# Altium schematic sheet cs301_YourGroupNumber3.SchDoc
size A4
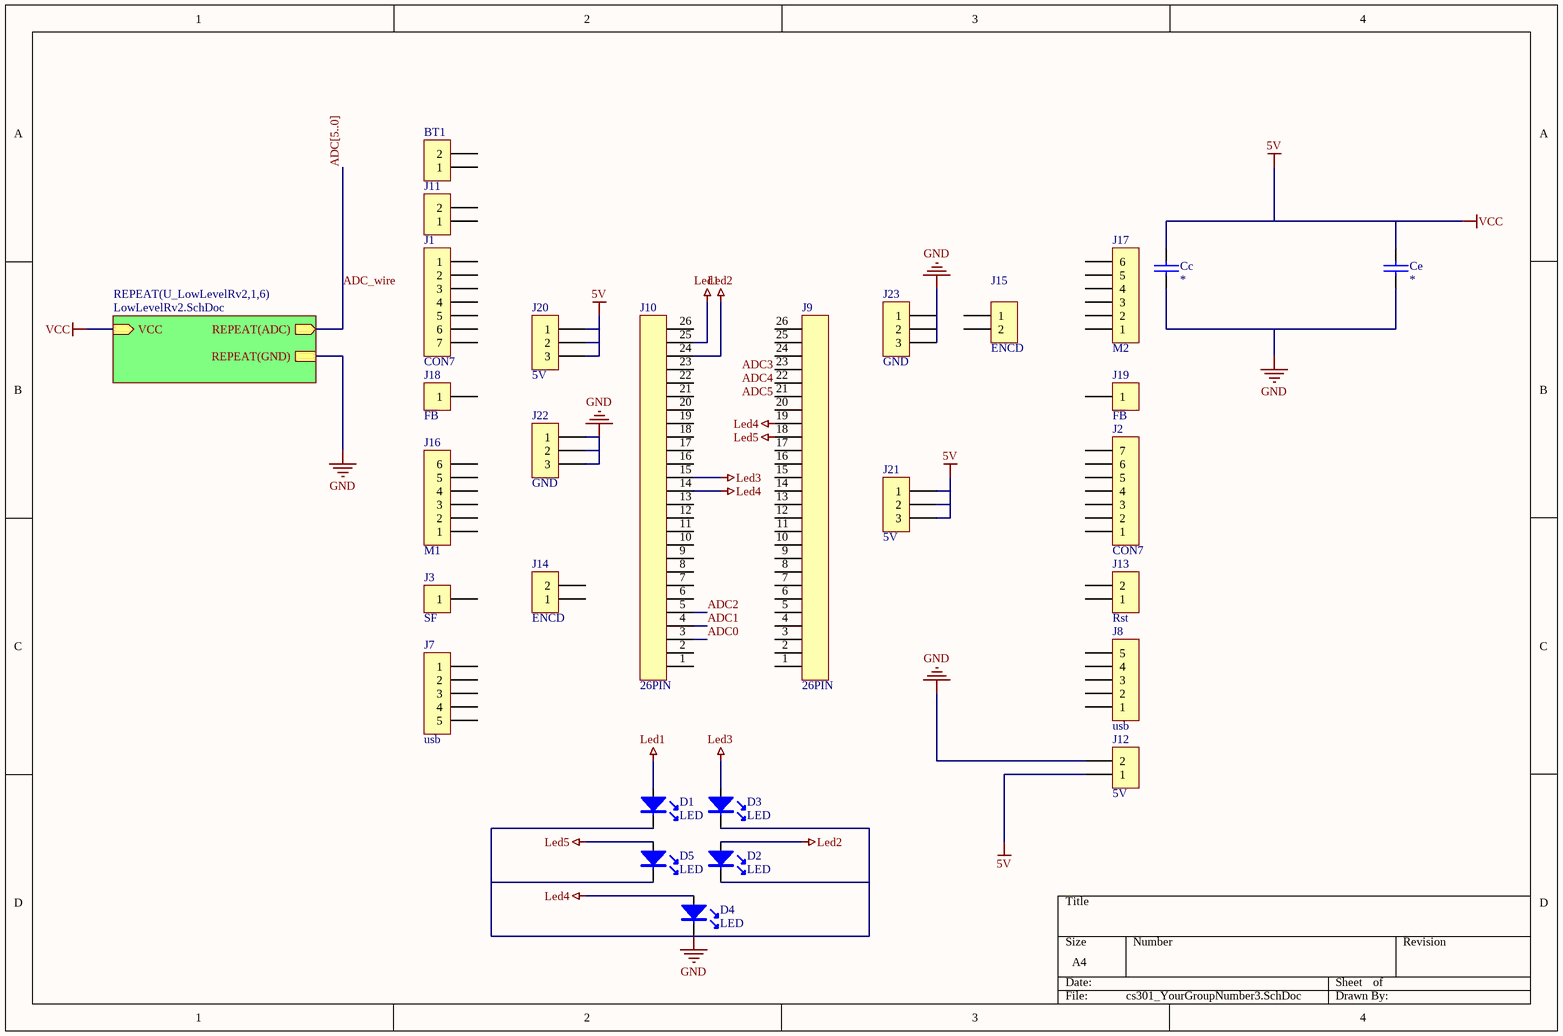
[diagram p0: cs301_YourGroupNumber3.SchDoc]

## Parts
BT1  Battery  [sip2]  (value not drawn)
Cc  *  [FILM CAP-0.2]
Ce  *  [FILM CAP-0.2]
D1  LED  [LED0.1/5MM]
D2  LED  [LED0.1/5MM]
D3  LED  [LED0.1/5MM]
D4  LED  [LED0.1/5MM]
D5  LED  [LED0.1/5MM]
J1  CON7  [SIP7]
J2  CON7  [SIP7]
J3  SF  [SIP1/0.6]
J7  usb  [SIP5]
J8  usb  [SIP5]
J9  26PIN  [SIP26]
J10  26PIN  [SIP26]
J11  Battery  [sip2]  (value not drawn)
J12  5V  [sip2]
J13  Rst  [sip2]
J14  ENCD  [sip2]
J15  ENCD  [sip2]
J16  M1  [sip6]
J17  M2  [sip6]
J18  FB  [SIP1/0.6]
J19  FB  [SIP1/0.6]
J20  5V  [sip3]
J21  5V  [sip3]
J22  GND  [sip3]
J23  GND  [sip3]

## Sub-sheets
REPEAT(U_LowLevelRv2,1,6) = LowLevelRv2.SchDoc: VCC (in), REPEAT(GND), REPEAT(ADC) (out)

## Nets
5V: Cc.1 Ce.1 J12.1 J20.1 J20.2 J20.3 J21.1 J21.2 J21.3 ; sheet REPEAT(U_LowLevelRv2,1,6)/VCC  [also labelled VCC]
GND: Cc.2 Ce.2 D1.K D2.K D3.K D4.K D5.K J12.2 J22.1 J22.2 J22.3 J23.1 J23.2 J23.3 ; sheet REPEAT(U_LowLevelRv2,1,6)/REPEAT(GND)
Led1: D1.A J10.25
Led2: D2.A J10.24
Led3: D3.A J10.15
Led4: D4.A J9.19 J10.14
Led5: D5.A J9.18
ADC0: J10.3
ADC1: J10.4
ADC2: J10.5
ADC3: J9.24
ADC4: J9.23
ADC5: J9.22
ADC_wire: sheet REPEAT(U_LowLevelRv2,1,6)/REPEAT(ADC)

Not connected (* = marked no-connect by the designer): BT1 1 2; J1 1 2 3 4 5 6 7; J2 1 2 3 4 5 6 7; J3 1; J7 1 2 3 4 5; J8 1 2 3 4 5; J9 1 2 3 4 5 6 7 8 9 10 11 12 13 14 15 16 17 20 21 25 26; J10 1 2 6 7 8 9 10 11 12 13 16 17 18 19 20 21 22 23 26; J11 1 2; J13 1 2; J14 1 2; J15 1 2; J16 1 2 3 4 5 6; J17 1 2 3 4 5 6; J18 1; J19 1

## Buses and harness runs
bus ADC[5..0]

## Library data of the parts
BT1 J11-J15 = CON2: Connector
Cc Ce = CAP: Capacitor Non Polarised Through Hole; Value: *
J1 J2 = CON7: Connector
J3 J18 J19 = CON1: Connector
J7 J8 = CON5: Connector
J16 J17 = CON6: Connector
J20-J23 = CON3: Connector